# Altium project BLE_HID_Gamepad.PrjPcb
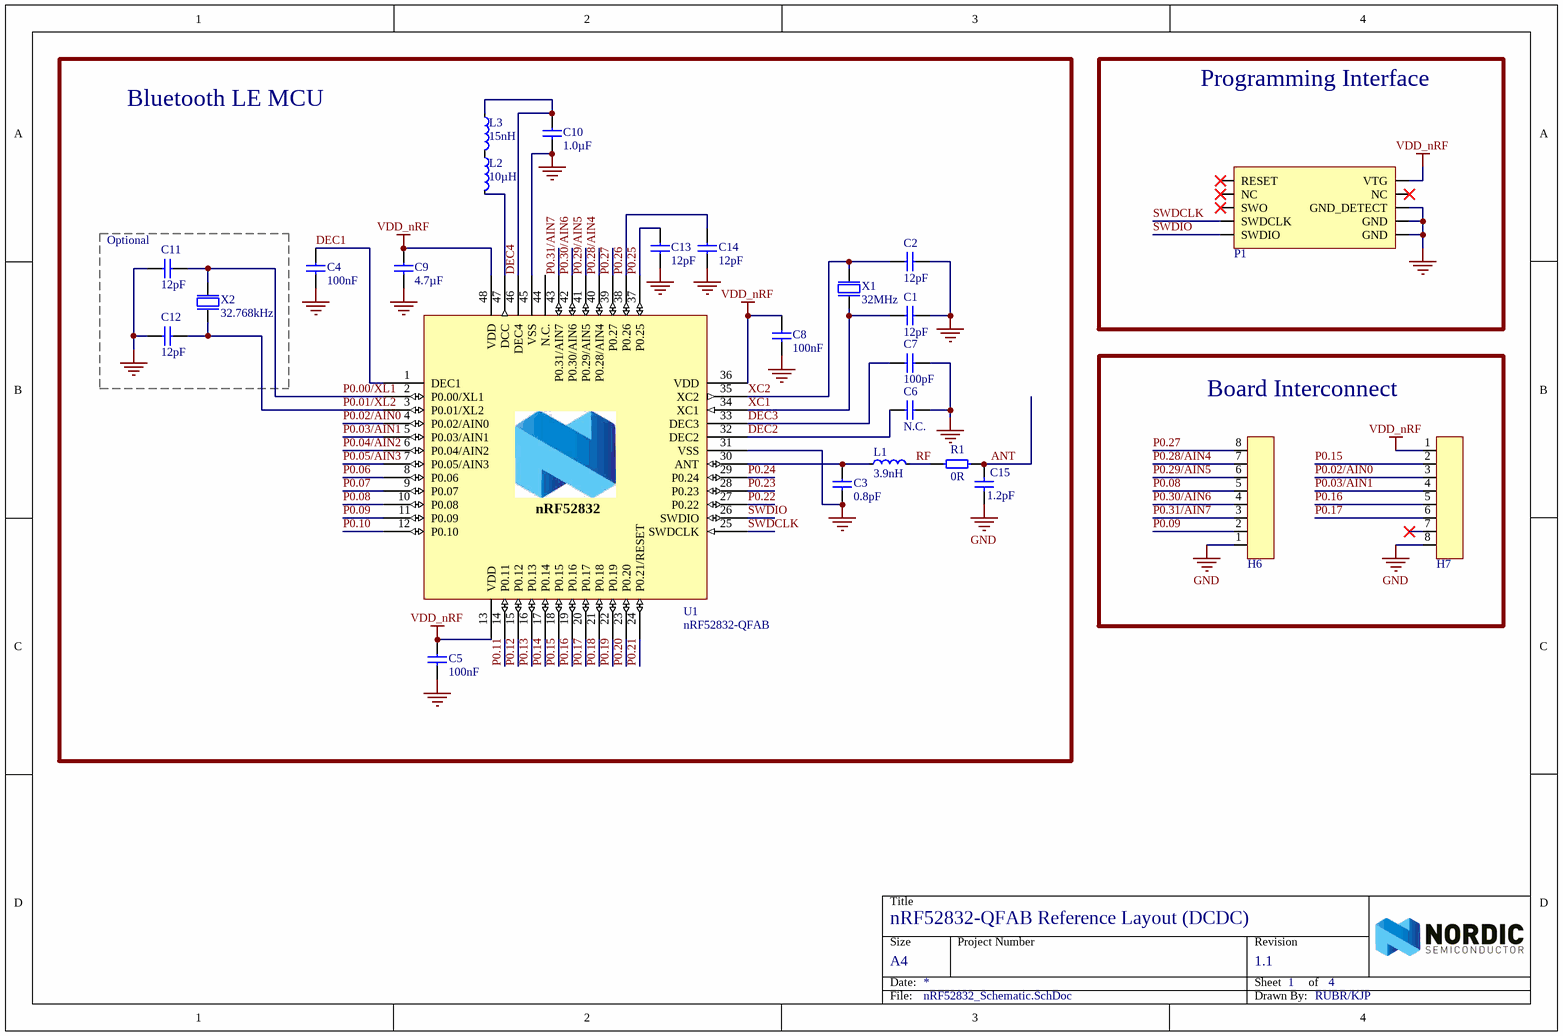
[diagram p0: nRF52832_Schematic.SchDoc]
4 sheets, 133 parts. Net scope: global (net labels, ports and power ports of the same name join across sheets).
Board file: BLE_Gamepad_PCB.PcbDoc
Sheets:
  nRF52832_Schematic.SchDoc
  Gamepad_IO.SchDoc
  Battery_Manager.SchDoc
  Gamepad_Sensors.SchDoc

## Sheet nRF52832_Schematic.SchDoc: nRF52832-QFAB Reference Layout (DCDC)
size A4; Revision: 1.1; SheetNumber: 1; SheetTotal: 4; DrawnBy: RUBR/KJP; DocumentSize: A4; PCAName: nRF52832-QFAB Reference Layout (DCDC)

### Parts
C1  12pF  [CAPC1005X04L]
C2  12pF  [CAPC1005X04L]
C3  0.8pF  [CAPC1005X04L]
C4  100nF  [CAPC1005X04L]
C5  100nF  [CAPC1005X04L]
C6  N.C.  [CAPC1005X04L]
C7  100pF  [CAPC1005X04L]
C8  100nF  [CAPC1005X04L]
C9  4.7µF  [CAPC1608X06L]
C10  1.0µF  [CAPC1608X06L]
C11  12pF  [CAPC1005X04L]
C12  12pF  [CAPC1005X04L]
C13  12pF  [CAPC1005X04L]
C14  12pF  [CAPC1005X04L]
C15  1.2pF  [0603 RF]
H6  8x1 Header  [SMD Header Male]  (value not drawn)
H7  8x1 Header  [SMD Header Male]  (value not drawn)
L1  3.9nH  [INDC1005X04L]
L2  10µH  [INDC1608X06L]
L3  15nH  [INDC1005X04L]
P1  JTag Connector  [JTAG 10 pin SMD]  (value not drawn)
R1  0R  [0603 RF]
U1  nRF52832-QFAB  [QFN40P600X600X90-48N]
X1  32MHz  [BT-XTAL_2016]
X2  32.768kHz  [XTAL_3215]

### Blocks framed on the sheet
Bluetooth LE MCU: C1-C15 L1-L3 R1 U1 X1 X2
Programming Interface: P1
Board Interconnect: H6 H7

### Nets
GND: C1.2 C2.2 C3.1 C4.2 C5.2 C6.1 C7.2 C8.2 C9.2 C10.1 C11.2 C12.2 C13.2 C14.2 C15.1 H6.1 H7.8 P1.7(GND) P1.8(GND) P1.10(GND_DETECT) U1.31(VSS) U1.45(VSS) U1.49(GND) X1.2(GND) X1.4(GND)
VDD_nRF: C5.1 C8.1 C9.1 H7.1 P1.6(VTG) U1.13(VDD) U1.36(VDD) U1.48(VDD)
ANT: C15.2 R1.2
DEC1: C4.1 U1.1(DEC1)
DEC2: C6.2 U1.32(DEC2)
DEC3: C7.1 U1.33(DEC3)
DEC4: C10.2 L3.1 U1.46(DEC4)
P0.00/XL1: C11.1 U1.2(P0.00/XL1) X2.1(inp)
P0.01/XL2: C12.1 U1.3(P0.01/XL2) X2.2(out)
P0.02/AIN0: H7.3 U1.4(P0.02/AIN0)
P0.03/AIN1: H7.4 U1.5(P0.03/AIN1)
P0.04/AIN2: U1.6(P0.04/AIN2)
P0.05/AIN3: U1.7(P0.05/AIN3)
P0.06: U1.8(P0.06)
P0.07: U1.9(P0.07)
P0.08: H6.5 U1.10(P0.08)
P0.09: H6.2 U1.11(P0.09)
P0.10: U1.12(P0.10)
P0.11: U1.14(P0.11)
P0.12: U1.15(P0.12)
P0.13: U1.16(P0.13)
P0.14: U1.17(P0.14)
P0.15: H7.2 U1.18(P0.15)
P0.16: H7.5 U1.19(P0.16)
P0.17: H7.6 U1.20(P0.17)
P0.18: U1.21(P0.18)
P0.19: U1.22(P0.19)
P0.20: U1.23(P0.20)
P0.21: U1.24(P0.21/RESET)
P0.22: U1.27(P0.22)
P0.23: U1.28(P0.23)
P0.24: U1.29(P0.24)
P0.25: C13.1 U1.37(P0.25)
P0.26: C14.1 U1.38(P0.26)
P0.27: H6.8 U1.39(P0.27)
P0.28/AIN4: H6.7 U1.40(P0.28/AIN4)
P0.29/AIN5: H6.6 U1.41(P0.29/AIN5)
P0.30/AIN6: H6.4 U1.42(P0.30/AIN6)
P0.31/AIN7: H6.3 U1.43(P0.31/AIN7)
RF: L1.2 R1.1
SWDCLK: P1.4(SWDCLK) U1.25(SWDCLK)
SWDIO: P1.5(SWDIO) U1.26(SWDIO)
XC1: C1.1 U1.34(XC1) X1.1(inp)
XC2: C2.1 U1.35(XC2) X1.3(out)
NetC3_2: C3.2 L1.1 U1.30(ANT)
NetL2_1: L2.1 L3.2
NetL2_2: L2.2 U1.47(DCC)

Not connected (* = marked no-connect by the designer): H7 7*; P1 1(RESET)* 2(NC)* 3(SWO)* 9(NC)*; U1 44(N.C.)

### Notes on the sheet
- (near C11) Optional
- Title
- Size
- Date:
- Project Number
- Sheet         of
- Revision
- File:
- Drawn By:
- (in symbol nRF52832-QFAB) nRF52832

### Library data of the parts
C1 C2 C11-C14 = C0402-12p: Capacitor, NP0, ±2%; Note: 50V; Artikkelnr Noca: 20029159; Artikkelnr Simpro: N.A.; Part Number: C0402-12p; Manufacturer: *; Manufacturer Part Number: *; Datasheet: *; LatestRevisionDate: 2011-05-11; Pin Count: 2; Publisher: Nordic Semiconductor; Published: 2009-05-08; Value: 12pF; Supplier: *; Supplier part number: *; 2nd source Supplier: *; 2nd source part number: *; Footprint Doc: 0402
C3 = C0402-0.8p: Capacitor, NP0, ±5%; Note: 50V; Artikkelnr Noca: 20029147; Artikkelnr Simpro: N.A.; Part Number: C0402-0.8p; Manufacturer: *; Manufacturer Part Number: *; Datasheet: *; LatestRevisionDate: 2012-11-21; Pin Count: 2; Publisher: Nordic Semiconductor; Published: 2009-05-08; Value: 0.8pF; Supplier: *; Supplier part number: *; 2nd source Supplier: *; 2nd source part number: *; Footprint Doc: 0402
C4 C5 C8 = C0402-100n: Capacitor, X7R, ±10%; Note: 16V; Artikkelnr Noca: 20039200; Artikkelnr Simpro: N.A.; Part Number: C0402-100n; Manufacturer: *; Manufacturer Part Number: *; Datasheet: *; LatestRevisionDate: 2009-11-23; Pin Count: 2; Publisher: Nordic Semiconductor; Published: 2009-05-08; Value: 100nF; Supplier: *; Supplier part number: *; 2nd source Supplier: *; 2nd source part number: *; Footprint Doc: 0402
C6 = C0402-N.C.: Not mounted; Note: Chip Cap; Artikkelnr Noca: N.A.; Part Number: C0402-N.C.; Manufacturer: *; Manufacturer Part Number: *; Datasheet: *; LatestRevisionDate: 2009-05-08; Pin Count: 2; Publisher: Nordic Semiconductor; Published: 2009-05-08; Value: N.C.; Supplier: *; Supplier part number: *; 2nd source Supplier: *; 2nd source part number: *; Footprint Doc: 0402; Artikkelnr Simpro: N.A.
C7 = C0402-100p: Capacitor, NP0, ±5%; Note: 50V; Artikkelnr Noca: 20029135; Artikkelnr Simpro: N.A.; Part Number: C0402-100p; Manufacturer: *; Manufacturer Part Number: *; Datasheet: *; LatestRevisionDate: 2009-05-08; Pin Count: 2; Publisher: Nordic Semiconductor; Published: 2009-05-08; Value: 100pF; Supplier: *; Supplier part number: *; 2nd source Supplier: *; 2nd source part number: *; Footprint Doc: 0402
C9 = C0603-4µ7: Capacitor, X5R, ±10%; Note: 6.3V; Artikkelnr Noca: 20069060; Artikkelnr Simpro: N.A.; Part Number: C0603-4µ7; Manufacturer: *; Manufacturer Part Number: *; Datasheet: *; LatestRevisionDate: 2009-11-23; Pin Count: 2; Publisher: Nordic Semiconductor; Published: 2009-05-08; Value: 4.7µF; Supplier: *; Supplier part number: *; 2nd source Supplier: *; 2nd source part number: *; Footprint Doc: 0603
C10 = C0603-1µ0: Capacitor, X7R, ±10%; Note: 16V; Artikkelnr Noca: 20039335; Artikkelnr Simpro: N.A.; Part Number: C0603-1µ0; Manufacturer: *; Manufacturer Part Number: *; Datasheet: *; LatestRevisionDate: 2013-06-05; Pin Count: 2; Publisher: Nordic Semiconductor; Published: 2009-05-08; Value: 1.0µF; Supplier: *; Supplier part number: *; 2nd source Supplier: *; 2nd source part number: *; Footprint Doc: 0603
C15 = Capacitor
L1 = L0402-3n9: High frequency chip inductor ±5%; Manufacturer: Murata; Manufacturer Part Number: LQP15MN3N9B02D; Artikkelnr Noca: 33029151; Artikkelnr Simpro: N.A.; Part Number: L0402-3n9; Datasheet: http://search.murata.co.jp/Ceramy/image/img/PDF/ENG/L0075S0084LQP15M.pdf; LatestRevisionDate: 2012-09-19; Pin Count: 2; Publisher: Nordic Semiconductor; Published: 2009-05-08; Value: 3.9nH; Note: High frequency chip inductor ±5%; Supplier: Digi-Key; Supplier part number: 490-1131-1-ND; 2nd source Supplier: *; 2nd source part number: *; Footprint Doc: 0402
L2 = L0603-10µ: Chip inductor, IDC,min = 50 mA, ±20%; Manufacturer: Taiyo Yuden; Manufacturer Part Number: LBMF1608T100K; 2nd source part number: 178-6105; Note: LBMF1608T100K 10µH 80mA 0603; Artikkelnr Noca: 33029314; Artikkelnr Simpro: N.A.; Part Number: L0603-10µ; Datasheet: http://www.yuden.co.jp/ut/product/pdf/elb2_e.pdf; LatestRevisionDate: 2012-09-19; Pin Count: 2; Publisher: Nordic Semiconductor; Published: 2010-02-24; Value: 10µH; Supplier: Digi-Key; Supplier part number: 587-1714-1-ND; 2nd source Supplier: Farnell; Footprint Doc: 0603
L3 = L0402-15n: High frequency chip inductor ±10%; Manufacturer: Taiyo Yuden; Manufacturer Part Number: HK100515NJ-T; 2nd source part number: 658-1328; Artikkelnr Noca: 33029323; Artikkelnr Simpro: N.A.; Part Number: L0402-15n; LatestRevisionDate: 2012-09-19; Pin Count: 2; Publisher: Nordic Semiconductor; Published: 2010-07-12; Value: 15nH; Note: High frequency chip inductor ±10%; Supplier: Digi-Key; Datasheet: http://www.yuden.co.jp/productdata/catalog/en/mlci04_e.pdf; Supplier part number: 587-1521-1-ND; 2nd source Supplier: Farnell; Footprint Doc: 0402
P1 = JTag Connector: SAMTEC - FTSH-105-01-F-DV-K - Pin Header, Keying Shroud, Wire-to-Board, 1.27 mm, 2 Rows, 10 Contacts, Surface Mount, FTSH Series; Max Current Rating: 1.75A; Number of Positions: 10; Connector Type: Male Pin; Pitch: 1.27mm; Row Spacing: 0.05inch; Supplier 1: Digi-Key; Manufacturer 1: Samtec; Manufacturer Part Number 1: FTSH-105-01-F-DV-K; RoHS: Yes; Category: Headers and Wire Housings; Stock 1: 4170; Pricing 1: 1=2.84000, 10=2.73100, 100=2.27590, 500=1.93452, 1000=1.65004, 5000=1.47934 (USD); Mount: Surface Mount; Contact Material: Copper,Bronze; Contact Plating: Gold; Color: Black; Housing Color: Black; Housing Material: Polymer; Min Operating Temperature: -55°C; Max Operating Temperature: 125°C; Number of Rows: 2; Packaging: Rail/Tube; Package Quantity: 1; Termination: Solder; Number of Contacts: 10; Orientation: Straight; Series: FTSH; Contact Type: Male Pin; Length: 15.2mm; Height: 3.3mm; Contact Mating Length: 0.12inch; Depth: 3.43mm; Radiation Hardening: No; Lead Free: Lead Free; RoHS Compliant: Yes; ComponentLink1URL: https://datasheet.ciiva.com/19461/2046846-19461026.pdf?src-supplier=Jameco; ComponentLink1Description: https://datasheet.ciiva.com/19461/2046846-19461026.pdf?src-supplier=Jameco; ComponentLink2URL: https://datasheet.ciiva.com/738/ftsh-1xx-xx-xxx-dv-xxx-mkt-738998.pdf?src-supplier=Digi-Key; ComponentLink2Description: https://datasheet.ciiva.com/738/ftsh-1xx-xx-xxx-dv-xxx-mkt-738998.pdf?src-supplier=Digi-Key; ComponentLink3URL: https://datasheet.ciiva.com/10245/ftsh-mt-10245273.pdf?src-supplier=Avnet; ComponentLink3Description: https://datasheet.ciiva.com/10245/ftsh-mt-10245273.pdf?src-supplier=Avnet; ComponentLink4URL: https://datasheet.ciiva.com/16657/ftsh-mt-16657371.pdf?src-supplier=Avnet+Europe; ComponentLink4Description: https://datasheet.ciiva.com/16657/ftsh-mt-16657371.pdf?src-supplier=Avnet+Europe; ComponentLink5URL: https://datasheet.ciiva.com/15195/getdatasheetpartid-133463-15195260.pdf?src-supplier=Verical; ComponentLink5Description: https://datasheet.ciiva.com/15195/getdatasheetpartid-133463-15195260.pdf?src-supplier=Verical; Supplier Part Number 1: SAM8796-ND
R1 = Resistor
U1 = nRF52832-QFAB: Multi-protocol Bluetooth Low Energy, ANT and 2.4GHz proprietary system-on-chip; Manufacturer: Nordic Semiconductor; Artikkelnr Noca: N.A.; Part Number: nRF52832-QFAB; Manufacturer Part Number: nRF52832-QFAB; Datasheet: *; LatestRevisionDate: 2016-11-24; Pin Count: 48; Publisher: Nordic Semiconductor; Published: 2016-11-24; Value: nRF52832-QFAB; Note: *; Supplier: Nordic Semiconductor; Supplier part number: *; 2nd source Supplier: *; 2nd source part number: *; Footprint Doc: QFN-48; Artikkelnr Simpro: N.A.
X1 = XTAL_SMD2016_32MHz_8pF_General: XTAL SMD 2016, 32MHz, Cl=8pF, Total Tol: ±40ppm; Note: XTAL SMD 32.000MHz; Artikkelnr Noca: N.A.; Part Number: XTAL_SMD2016_32MHz_8pF_General; Manufacturer: *; Manufacturer Part Number: *; Datasheet: *; LatestRevisionDate: 2016-08-19; Pin Count: 4; Publisher: Nordic Semiconductor; Published: 2016-08-19; Value: 32MHz; Supplier: *; Supplier part number: *; 2nd source Supplier: *; 2nd source part number: *; Footprint Doc: XTAL_2016; Artikkelnr Simpro: N.A.
X2 = XTAL_SMD3215_32.768kHz_9pF_General: XTAL SMD 3215, 32.768kHz, Cl=9pF, Total Tol: ±50ppm; Note: XTAL SMD 32.768kHz; Artikkelnr Noca: N.A.; Part Number: XTAL_SMD3215_32.768kHz_9pF_General; Manufacturer: *; Manufacturer Part Number: *; Datasheet: *; LatestRevisionDate: 2016-08-19; Pin Count: 2; Publisher: Nordic Semiconductor; Published: 2016-08-19; Value: 32.768kHz; Supplier: *; Supplier part number: *; 2nd source Supplier: *; 2nd source part number: *; Footprint Doc: XTAL_3215; Artikkelnr Simpro: N.A.

## Sheet Gamepad_IO.SchDoc
size A; SheetNumber: 2; SheetTotal: 4
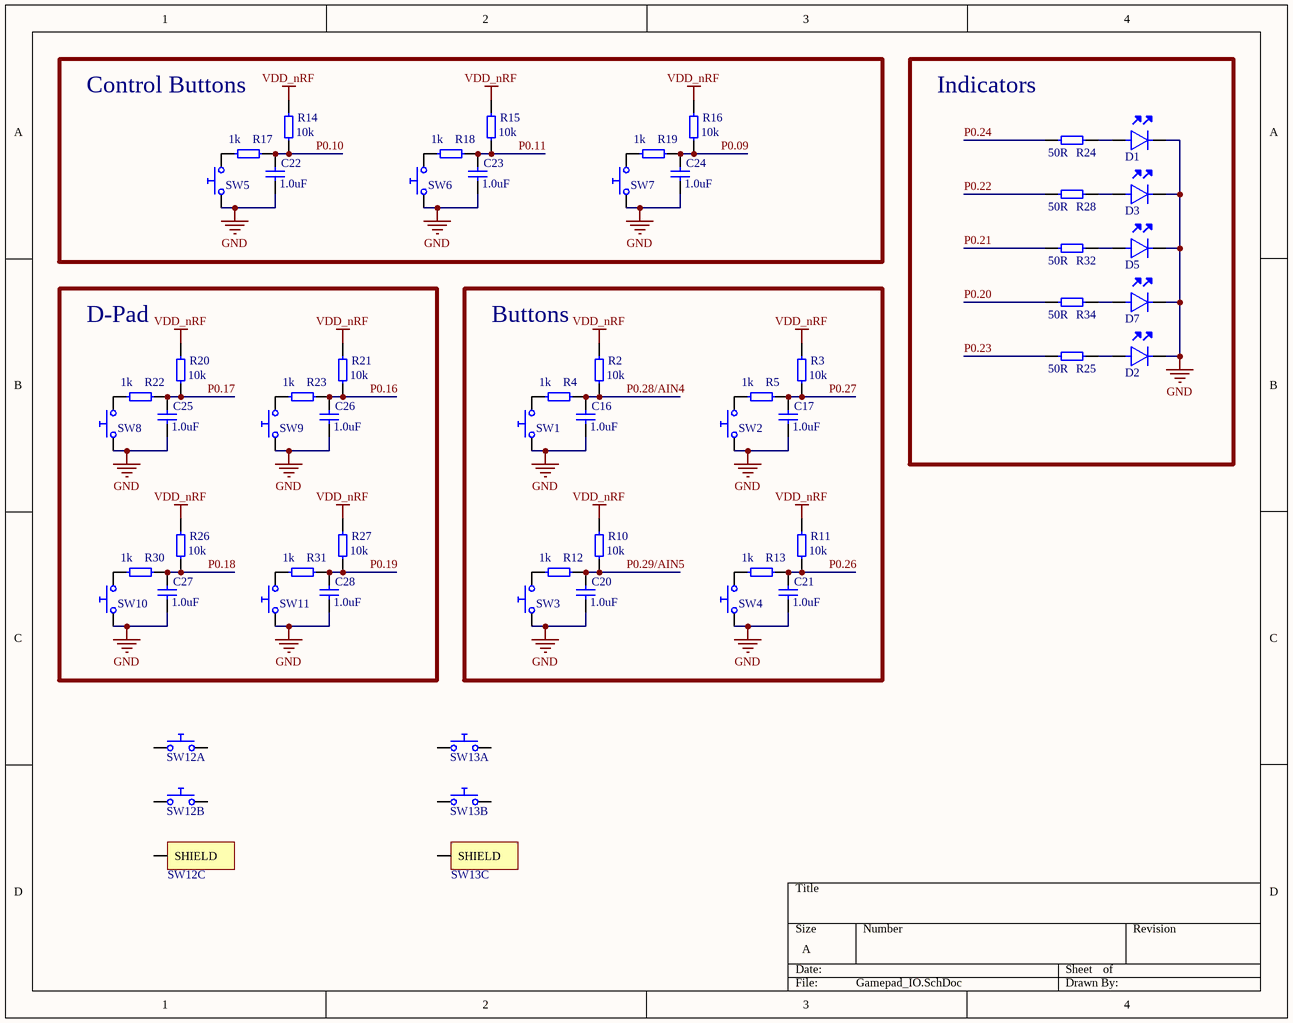
[diagram p1: Gamepad_IO.SchDoc]

### Parts
C16  1.0uF  [0603 Capacitor]
C17  1.0uF  [0603 Capacitor]
C20  1.0uF  [0603 Capacitor]
C21  1.0uF  [0603 Capacitor]
C22  1.0uF  [0603 Capacitor]
C23  1.0uF  [0603 Capacitor]
C24  1.0uF  [0603 Capacitor]
C25  1.0uF  [0603 Capacitor]
C26  1.0uF  [0603 Capacitor]
C27  1.0uF  [0603 Capacitor]
C28  1.0uF  [0603 Capacitor]
D1  LED  [0603 LED]  (value not drawn)
D2  LED  [0603 LED]  (value not drawn)
D3  LED  [0603 LED]  (value not drawn)
D5  LED  [0603 LED]  (value not drawn)
D7  LED  [0603 LED]  (value not drawn)
R2  10k  [0603 Resistor]
R3  10k  [0603 Resistor]
R4  1k  [0603 Resistor]
R5  1k  [0603 Resistor]
R10  10k  [0603 Resistor]
R11  10k  [0603 Resistor]
R12  1k  [0603 Resistor]
R13  1k  [0603 Resistor]
R14  10k  [0603 Resistor]
R15  10k  [0603 Resistor]
R16  10k  [0603 Resistor]
R17  1k  [0603 Resistor]
R18  1k  [0603 Resistor]
R19  1k  [0603 Resistor]
R20  10k  [0603 Resistor]
R21  10k  [0603 Resistor]
R22  1k  [0603 Resistor]
R23  1k  [0603 Resistor]
R24  50R  [0603 Resistor]
R25  50R  [0603 Resistor]
R26  10k  [0603 Resistor]
R27  10k  [0603 Resistor]
R28  50R  [0603 Resistor]
R30  1k  [0603 Resistor]
R31  1k  [0603 Resistor]
R32  50R  [0603 Resistor]
R34  50R  [0603 Resistor]
SW1  Switch Button  [ButtonPad Version 1]  (value not drawn)
SW2  Switch Button  [ButtonPad Version 1]  (value not drawn)
SW3  Switch Button  [ButtonPad Version 1]  (value not drawn)
SW4  Switch Button  [ButtonPad Version 1]  (value not drawn)
SW5  Switch Button  [ButtonPad Version 1]  (value not drawn)
SW6  Switch Button  [ButtonPad Version 1]  (value not drawn)
SW7  Switch Button  [ButtonPad Version 1]  (value not drawn)
SW8  Switch Button  [ButtonPad Version 1]  (value not drawn)
SW9  Switch Button  [ButtonPad Version 1]  (value not drawn)
SW10  Switch Button  [ButtonPad Version 1]  (value not drawn)
SW11  Switch Button  [ButtonPad Version 1]  (value not drawn)
SW12  TL2243  [TL2243]  (value not drawn)  (parts A,B,C of 3)
SW13  TL2243  [TL2243]  (value not drawn)  (parts A,B,C of 3)

### Blocks framed on the sheet
Control Buttons: C22-C24 R14-R19 SW5-SW7
Indicators: D1-D3 D5 D7 R24 R25 R28 R32 R34
D-Pad: C25-C28 R20-R23 R26 R27 R30 R31 SW8-SW11
Buttons: C16 C17 C20 C21 R2-R5 R10-R13 SW1-SW4

### Nets
GND: C16.1 C17.1 C20.1 C21.1 C22.1 C23.1 C24.1 C25.1 C26.1 C27.1 C28.1 D1.2 D2.2 D3.2 D5.2 D7.2 SW1.1 SW2.1 SW3.1 SW4.1 SW5.1 SW6.1 SW7.1 SW8.1 SW9.1 SW10.1 SW11.1
VDD_nRF: R2.2 R3.2 R10.2 R11.2 R14.2 R15.2 R16.2 R20.2 R21.2 R26.2 R27.2
P0.09: C24.2 R16.1 R19.2
P0.10: C22.2 R14.1 R17.2
P0.11: C23.2 R15.1 R18.2
P0.16: C26.2 R21.1 R23.2
P0.17: C25.2 R20.1 R22.2
P0.18: C27.2 R26.1 R30.2
P0.19: C28.2 R27.1 R31.2
P0.20: R34.1
P0.21: R32.1
P0.22: R28.1
P0.23: R25.1
P0.24: R24.1
P0.26: C21.2 R11.1 R13.2
P0.27: C17.2 R3.1 R5.2
P0.28/AIN4: C16.2 R2.1 R4.2
P0.29/AIN5: C20.2 R10.1 R12.2
NetD1_1: D1.1 R24.2
NetD2_1: D2.1 R25.2
NetD3_1: D3.1 R28.2
NetD5_1: D5.1 R32.2
NetD7_1: D7.1 R34.2
NetR4_1: R4.1 SW1.2
NetR5_1: R5.1 SW2.2
NetR12_1: R12.1 SW3.2
NetR13_1: R13.1 SW4.2
NetR17_1: R17.1 SW5.2
NetR18_1: R18.1 SW6.2
NetR19_1: R19.1 SW7.2
NetR22_1: R22.1 SW8.2
NetR23_1: R23.1 SW9.2
NetR30_1: R30.1 SW10.2
NetR31_1: R31.1 SW11.2

Not connected (* = marked no-connect by the designer): SW12 1 2 3 4 SHIELD; SW13 1 2 3 4 SHIELD

### Library data of the parts
C16 C17 C20-C28 = Capacitor
R2-R5 R10-R28 R30-R32 R34 = Resistor
SW12 SW13 = TL2243: SWITCH TACTILE SPSTX2 0.05A 12V; Manufacturer 1: E-Switch; Mechanical Life: 30000Cycles; Voltage Rating (DC): 100V; Throw Configuration: SPST; Contact Resistance: 100mR; Operating Force: 180gf; Current Rating: 50mA; Illumination Type: Non-Illuminated,Illuminated; Switch Travel: 0.25mm; Switch Function: Off-Mom; Actuator Length: 3.8mm; Supplier 1: Digi-Key; Supplier Part Number 1: EG4606-ND; Manufacturer Part Number 1: TL2243; RoHS: Yes; Category: Tactile Switches; Stock 1: 5183; Pricing 1: 1=0.69000, 10=0.66200, 25=0.63640, 100=0.55230, 250=0.50396, 500=0.46832, 1000=0.41996, 2500=0.39450, 5000=0.36651 (USD); Mount: Through Hole; Contact Material: Silver; Min Operating Temperature: -20°C; Max Operating Temperature: 70°C; Package Quantity: 600; Packaging: Bulk; Max Voltage Rating (DC): 12V; Termination: PC Pin; Electrical Life: 30000Cycles; Orientation: Right Angle; Series: TL2243; Size: 7.3mm; Lead Free: Lead Free; RoHS Compliant: Yes; ComponentLink1URL: https://datasheet.ciiva.com/2900/tl2243-2900969.pdf?src-supplier=Digi-Key; ComponentLink1Description: https://datasheet.ciiva.com/2900/tl2243-2900969.pdf?src-supplier=Digi-Key; ComponentLink2URL: https://datasheet.ciiva.com/13526/tl2243-26358-13526538.pdf?src-supplier=Mouser; ComponentLink2Description: https://datasheet.ciiva.com/13526/tl2243-26358-13526538.pdf?src-supplier=Mouser; ComponentLink3URL: https://datasheet.ciiva.com/31840/p010405-31840495.pdf?src-supplier=Onlinecomponents.com; ComponentLink3Description: https://datasheet.ciiva.com/31840/p010405-31840495.pdf?src-supplier=Onlinecomponents.com; ComponentLink4URL: https://datasheet.ciiva.com/16370/p010405m-16370087.pdf?src-supplier=Future+Electronics; ComponentLink4Description: https://datasheet.ciiva.com/16370/p010405m-16370087.pdf?src-supplier=Future+Electronics

## Sheet Battery_Manager.SchDoc
size A; SheetNumber: 3; SheetTotal: 4
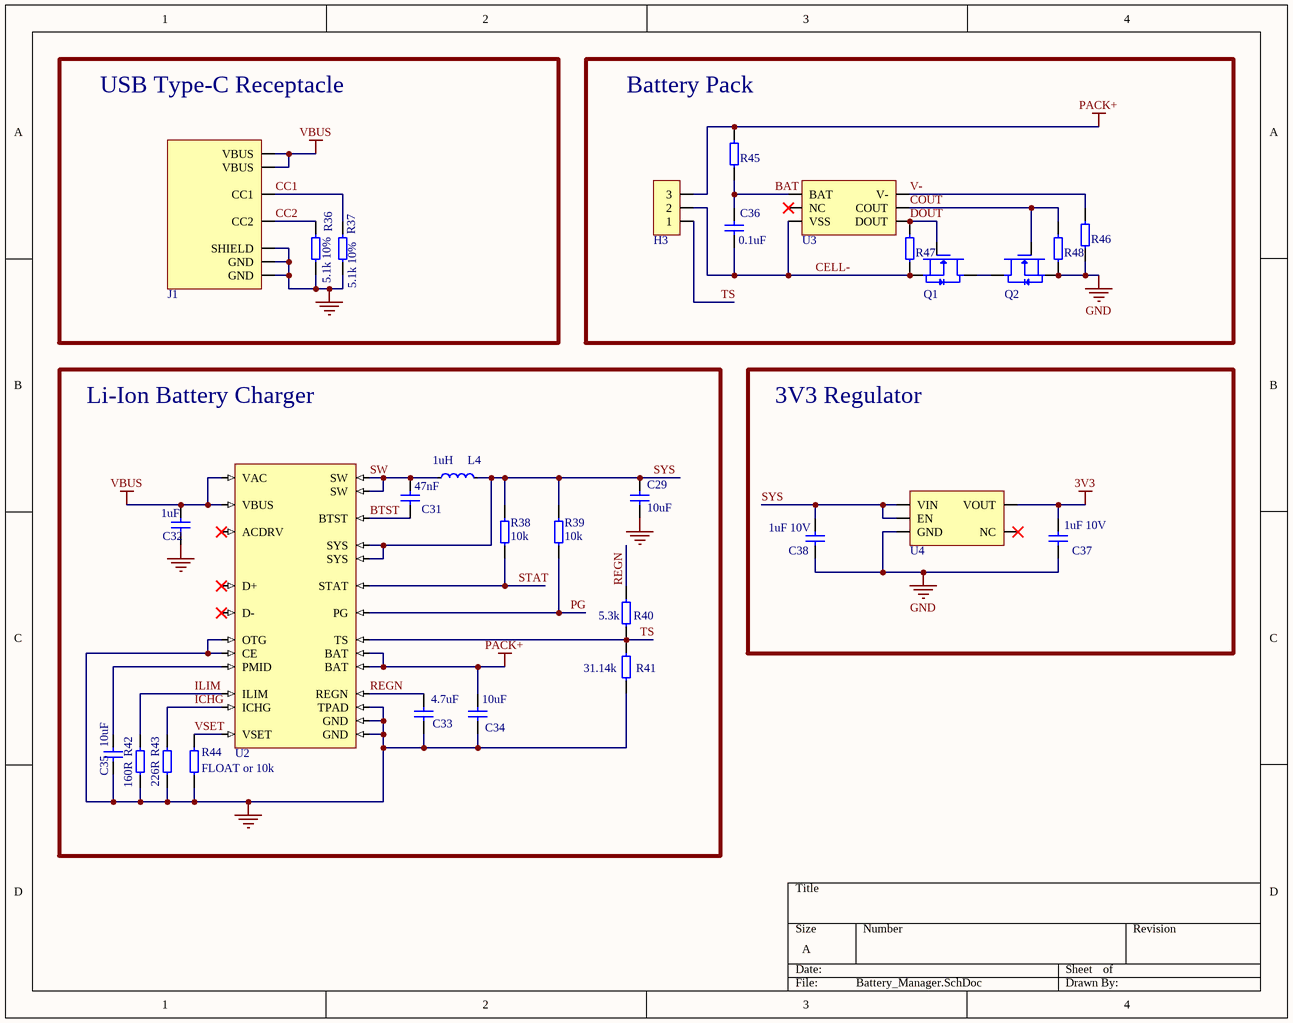
[diagram p2: Battery_Manager.SchDoc]

### Parts
C29  10uF  [0603 Capacitor]
C31  47nF  [0603 Capacitor]
C32  1uF  [0603 Capacitor]
C33  4.7uF  [0603 Capacitor]
C34  10uF  [0603 Capacitor]
C35  10uF  [0603 Capacitor]
C36  0.1uF  [0603 Capacitor]
C37  1uF 10V  [0603 Capacitor]
C38  1uF 10V  [0603 Capacitor]
H3  22-05-7035  [Molex Header 3]  (value not drawn)
J1  USB4125-GF-A  [USB4125]  (value not drawn)
L4  1uH  [SRP2510A]
Q1  CSD16406Q3  [CSD16406Q3]  (value not drawn)
Q2  CSD16406Q3  [CSD16406Q3]  (value not drawn)
R36  5.1k 10%  [0603 Resistor]
R37  5.1k 10%  [0603 Resistor]
R38  10k  [0603 Resistor]
R39  10k  [0603 Resistor]
R40  5.3k  [0603 Resistor]
R41  31.14k  [0603 Resistor]
R42  160R  [0603 Resistor]
R43  226R  [0603 Resistor]
R44  FLOAT or 10k  [0603 Resistor]
R45  330R  [0603 Resistor]  (value not drawn)
R46  2.2k  [0603 Resistor]  (value not drawn)
R47  5M  [0603 Resistor]  (value not drawn)
R48  5M  [0603 Resistor]  (value not drawn)
U2  BQ25616JRTWR  [BQ25616]  (value not drawn)
U3  BQ29700DSET  [BQ297xx]  (value not drawn)
U4  MIC5504-3.3YM5-TR  [MIC5504]  (value not drawn)

### Blocks framed on the sheet
USB Type-C Receptacle: J1 R36 R37
Battery Pack: C36 H3 Q1 Q2 R45-R48 U3
Li-Ion Battery Charger: C29 C31-C35 L4 R38-R44 U2
3V3 Regulator: C37 C38 U4

### Nets
3V3: C37.2 U4.5(VOUT)
GND: C29.1 C32.1 C33.1 C34.1 C35.1 C37.1 C38.1 J1.A12(GND) J1.B12(GND) J1.SHIELD Q2.1 R36.1 R37.1 R41.1 R42.1 R43.1 R44.1 R46.1 R48.1 U2.6(OTG) U2.9(CE) U2.17(GND) U2.18(GND) U2.25(TPAD) U4.2(GND)
PACK+: C34.2 H3.3 R45.2 U2.13(BAT) U2.14(BAT)
VBUS: C32.2 J1.A9(VBUS) J1.B9(VBUS) U2.1(VAC) U2.24(VBUS)
BAT: C36.2 R45.1 U3.5(BAT)
BTST: C31.1 U2.21(BTST)
CC1: J1.A5(CC1) R37.2
CC2: J1.B5(CC2) R36.2
CELL-: C36.1 H3.2 Q1.1 R47.1 U3.4(VSS)
COUT: Q2.4 R48.2 U3.2(COUT)
DOUT: Q1.4 R47.2 U3.3(DOUT)
ICHG: R43.2 U2.10(ICHG)
ILIM: R42.2 U2.8(ILIM)
PG: R39.1 U2.7(PG)
REGN: C33.2 R40.2 U2.22(REGN)
STAT: R38.1 U2.5(STAT)
SW: C31.2 L4.1 U2.19(SW) U2.20(SW)
SYS: C29.2 C38.2 L4.2 R38.2 R39.2 U2.15(SYS) U2.16(SYS) U4.1(VIN) U4.3(EN)
TS: H3.1 R40.1 R41.2 U2.11(TS)
V-: R46.2 U3.6(V-)
VSET: R44.2 U2.12(VSET)
NetC35_2: C35.2 U2.23(PMID)
NetQ1_5: Q1.5 Q2.5

Not connected (* = marked no-connect by the designer): U2 2(ACDRV)* 3(D+)* 4(D-)*; U3 1(NC)*; U4 4(NC)*

### Library data of the parts
C29 C31-C38 = Capacitor
H3 = 22-05-7035: Header 2.5mm SPOX,  WTB,  RA,  F/lock,  3w; Manufacturer 1: Molex; Voltage Rating: 250V; Current Rating: 3A; Gender: Male; Contact Resistance: 20mR; Number of Positions: 3; Max Voltage Rating (DC): 250.25kV; Insulation Resistance: 1GR; Shrouded: Yes (With); Test Voltage: 1kV; Glow Wire Compliant: Non-compliant; Supplier 1: Digi-Key; Supplier Part Number 1: WM18901-ND; Manufacturer Part Number 1: 22-05-7035; RoHS: Yes; Category: Headers and Wire Housings; Stock 1: 4209; Pricing 1: 1=0.26000, 10=0.20600, 100=0.14770, 1000=0.11562, 5000=0.10278, 10000=0.09314 (USD); Mount: Through Hole; Contact Plating: Tin,Copper; Contact Material: Brass; Housing Color: Natural; Color: Natural; Housing Material: Nylon; Contact Shape: Circular; Contact Finish - Mating: TIN; Insulation Material: Nylon; Insulation Color: Natural; Min Operating Temperature: -40°C; Max Operating Temperature: 105°C; Package Quantity: 20000; Packaging: Bulk; Termination: Solder; Number of Rows: 1; Number of Contacts: 3; Orientation: Right Angle; Voltage Rating (DC): 250V; Number of Circuits: 3; Contact Gender: Male; Connector Type: Header; Max Voltage Rating (AC): 250V; Number of Poles: 3; Max Current Rating: 3A; Fastening Type: Detent; Series: Mini-SPOX 5268; Contact Type: Male Pin; Length: 9.9mm; Height: 4.9mm; Pitch: 2.5mm; Depth: 7.9mm; Radiation Hardening: No; REACH SVHC: Unknown; Lead Free: Lead Free; RoHS Compliant: Yes; Flammability Rating: UL94 V-0; ComponentLink1URL: https://datasheet.ciiva.com/30128/225440022057035-pcb-headers-30128301.pdf?src-supplier=Onlinecomponents.com; ComponentLink1Description: https://datasheet.ciiva.com/30128/225440022057035-pcb-headers-30128301.pdf?src-supplier=Onlinecomponents.com; ComponentLink2URL: https://datasheet.ciiva.com/11746/0900766b80da772d-11746287.pdf?src-supplier=RSComponents; ComponentLink2Description: https://datasheet.ciiva.com/11746/0900766b80da772d-11746287.pdf?src-supplier=RSComponents; ComponentLink3URL: https://datasheet.ciiva.com/5153/0022057035-pcb-headers-158546-5153221.pdf?src-supplier=Mouser; ComponentLink3Description: https://datasheet.ciiva.com/5153/0022057035-pcb-headers-158546-5153221.pdf?src-supplier=Mouser; ComponentLink4URL: https://datasheet.ciiva.com/19461/1965939-19461711.pdf?src-supplier=Jameco; ComponentLink4Description: https://datasheet.ciiva.com/19461/1965939-19461711.pdf?src-supplier=Jameco; ComponentLink5URL: https://datasheet.ciiva.com/7167/1869086-7167685.pdf?src-supplier=Newark; ComponentLink5Description: https://datasheet.ciiva.com/7167/1869086-7167685.pdf?src-supplier=Newark
J1 = USB4125-GF-A: Conn Rcp USB2.0 Typ C 24P SMD Ra; Manufacturer 1: GCT; Supplier 1: Digi-Key; Supplier Part Number 1: 1812J0160470FFT-ND; Manufacturer Part Number 1: USB4125-GF-A
L4 = SRP2510A-1R0M: BOURNS - SRP2510A-1R0M - INDUCTOR, 1UH, 3A, 20%, SHIELDED; Core Material: Ferrite; Saturation Current: 3.5A; DC Resistance (DCR): 54mR; Self Resonant Frequency: 94MHz; Test Frequency: 1MHz; Supplier 1: Digi-Key; Supplier Part Number 1: SRP2510A-1R0MCT-ND; Manufacturer 1: Bourns; Manufacturer Part Number 1: SRP2510A-1R0M; RoHS: Yes; Category: Fixed Inductors; Stock 1: 5280; Pricing 1: 1=0.53000, 10=0.46200, 25=0.42880, 50=0.36300, 100=0.33000, 250=0.31020, 500=0.27720, 1000=0.22440 (USD); Mount: Surface Mount; Case/Package: 1008; Case Code (Imperial): 1008; Case Code (Metric): 2520; Min Operating Temperature: -40°C; Max Operating Temperature: 125°C; Resistor Type: Wirewound; Packaging: Cut Tape; Inductance: 1uH; Tolerance: 20%; Current Rating: 3A; Shielding: Shielded; Ratings: AEC-Q200; RoHS Compliant: Yes; ComponentLink1URL: http://www.farnell.com/datasheets/2330876.pdf?src-supplier=Farnell; ComponentLink1Description: http://www.farnell.com/datasheets/2330876.pdf?src-supplier=Farnell; ComponentLink2URL: http://www.farnell.com/datasheets/2330876.pdf?src-supplier=Newark; ComponentLink2Description: http://www.farnell.com/datasheets/2330876.pdf?src-supplier=Newark; ComponentLink3URL: https://www.bourns.com/docs/Product-Datasheets/srp2510a.pdf?src-supplier=Digi-Key; ComponentLink3Description: https://www.bourns.com/docs/Product-Datasheets/srp2510a.pdf?src-supplier=Digi-Key
Q1 Q2 = CSD16406Q3: TEXAS INSTRUMENTS - CSD16406Q3 - N CHANNEL MOSFET, 25V, 60A, SON; Rise Time: 12.9ns; Rds On Max: 5.3mR; Input Capacitance: 1.1nF; Nominal Vgs: 1.7V; Max Power Dissipation: 2.7W; Fall Time: 4.8ns; Turn-Off Delay Time: 8.5ns; Gate to Source Voltage (Vgs): 16V; Turn-On Delay Time: 7.3ns; Number of Elements: 1; Element Configuration: Single; Polarity: N-CHANNEL; Supplier 1: Digi-Key; Supplier Part Number 1: 296-24251-1-ND; Manufacturer 1: Texas Instruments; Manufacturer Part Number 1: CSD16406Q3; RoHS: Yes; Category: MOSFETs; Stock 1: 13974; Pricing 1: 1=1.17000, 10=0.95900, 25=0.94160, 100=0.74610, 500=0.63244, 1000=0.51518 (USD); Mount: Surface Mount; Case/Package: SON; Number of Pins: 8; Contact Plating: Tin,Matte; Min Operating Temperature: -55°C; Max Operating Temperature: 150°C; Packaging: Tape and Reel; Package Quantity: 1; Dual Supply Voltage: 25V; Drain to Source Voltage (Vdss): 25V; Continuous Drain Current (ID): 60A; Drain to Source Breakdown Voltage: 25V; Power Dissipation: 2.7W; Termination: SMD/SMT; Threshold Voltage: 1.7V; Series: NexFET™; Radiation Hardening: No; REACH SVHC: No SVHC; Lead Free: Contains Lead; RoHS Compliant: Yes; ComponentLink1URL: https://datasheet.ciiva.com/14192/slps202a-14192882.pdf?src-supplier=Avnet; ComponentLink1Description: https://datasheet.ciiva.com/14192/slps202a-14192882.pdf?src-supplier=Avnet; ComponentLink2URL: https://datasheet.ciiva.com/6387/csd16406q3-6387192.pdf?src-supplier=Digi-Key; ComponentLink2Description: https://datasheet.ciiva.com/6387/csd16406q3-6387192.pdf?src-supplier=Digi-Key; ComponentLink3URL: https://datasheet.ciiva.com/4438/slps202a-128073-4438442.pdf?src-supplier=Mouser; ComponentLink3Description: https://datasheet.ciiva.com/4438/slps202a-128073-4438442.pdf?src-supplier=Mouser; ComponentLink4URL: https://datasheet.ciiva.com/1255/csd16406q3-1255292.pdf?src-supplier=Newark; ComponentLink4Description: https://datasheet.ciiva.com/1255/csd16406q3-1255292.pdf?src-supplier=Newark; ComponentLink5URL: https://datasheet.ciiva.com/5832/483980-5832634.pdf?src-supplier=Farnell; ComponentLink5Description: https://datasheet.ciiva.com/5832/483980-5832634.pdf?src-supplier=Farnell; ComponentLink6URL: https://datasheet.ciiva.com/5832/483980-5832635.pdf?src-supplier=Farnell; ComponentLink6Description: https://datasheet.ciiva.com/5832/483980-5832635.pdf?src-supplier=Farnell; ComponentLink7URL: https://datasheet.ciiva.com/7643/1389665-7643292.pdf?src-supplier=Element14; ComponentLink7Description: https://datasheet.ciiva.com/7643/1389665-7643292.pdf?src-supplier=Element14; ComponentLink8URL: https://datasheet.ciiva.com/14423/slps202a-14423477.pdf?src-supplier=Avnet; ComponentLink8Description: https://datasheet.ciiva.com/14423/slps202a-14423477.pdf?src-supplier=Avnet; ComponentLink9URL: https://datasheet.ciiva.com/6387/csd16406q3-6387195.pdf?src-supplier=Digi-Key; ComponentLink9Description: https://datasheet.ciiva.com/6387/csd16406q3-6387195.pdf?src-supplier=Digi-Key; ComponentLink10URL: https://datasheet.ciiva.com/6387/csd16406q3-6387198.pdf?src-supplier=Digi-Key; ComponentLink10Description: https://datasheet.ciiva.com/6387/csd16406q3-6387198.pdf?src-supplier=Digi-Key
R36-R48 = Resistor
U2 = BQ25616JRTWR: Manufacturer 1: Texas Instruments; Supplier 1: Digi-Key; Supplier Part Number 1: 296-BQ25616JRTWRCT-ND; Manufacturer Part Number 1: BQ25616JRTWR; RoHS: Yes; Category: Battery Management; Stock 1: 553; Pricing 1: 1=3.10000, 10=2.78100, 25=2.62360, 100=2.23520, 250=2.09880, 500=1.83644, 1000=1.65330 (USD)
U3 = BQ29700DSET: Li-Ion/Li Polymer Advanced Single-Cell Battery Protector IC Family 6-WSON -40 to 85; Manufacturer 1: Texas Instruments; Number of Batteries: 1; Min Supply Voltage: 1.5V; Max Supply Voltage: 8V; Output Voltage: 28V; Output Current: 5.5uA; Operating Supply Current: 4uA; Fault Protection: Over Current,Short Circuit,Over/Under Voltage; Supplier 1: Digi-Key; Supplier Part Number 1: 296-37746-1-ND; Manufacturer Part Number 1: BQ29700DSET; RoHS: Yes; Category: Battery Management; Stock 1: 86; Pricing 1: 1=0.69000, 10=0.60500, 25=0.56840, 100=0.43090 (USD); Mount: Surface Mount; Case/Package: WFDFN; Number of Pins: 6; Weight: 0.000342oz; Contact Plating: Gold; Min Operating Temperature: -40°C; Max Operating Temperature: 85°C; Packaging: Tape and Reel; Number of Cells: 1; Max Output Voltage: 8V; Package Quantity: 250; Length: 1.55mm; Width: 1.55mm; Height: 0.8mm; Radiation Hardening: No; REACH SVHC: No SVHC; Lead Free: Lead Free; RoHS Compliant: Yes; ComponentLink1URL: https://datasheet.ciiva.com/46402/1817247-46402997.pdf?src-supplier=Element14; ComponentLink1Description: https://datasheet.ciiva.com/46402/1817247-46402997.pdf?src-supplier=Element14
U4 = MIC5504-3.3YM5-TR: MICROCHIP - MIC5504-3.3YM5-TR - LDO VOLT REG, 0.3A, 3.3V, SOT-23-5; Min Input Voltage: 2.5V; Max Input Voltage: 5.5V; Output Current: 300mA; Dropout Voltage: 380mV; Number of Outputs: 1; Quiescent Current: 38uA; Accuracy: 3%; Operating Supply Current: 42uA; Power Supply Rejection Ratio (PSRR): 60dB; Output Type: Fixed; Supplier 1: Digi-Key; Supplier Part Number 1: 576-4764-1-ND; Manufacturer 1: Microchip; Manufacturer Part Number 1: MIC5504-3.3YM5-TR; RoHS: Yes; Category: Voltage Regulators - Linear; Stock 1: 29072; Pricing 1: 1=0.13000, 25=0.09000 (USD); Mount: Surface Mount; Case/Package: SOT-23-5; Number of Pins: 5; Min Operating Temperature: -40°C; Max Operating Temperature: 125°C; Nominal Output Voltage: 3.3V; Packaging: Tape and Reel; Output Voltage: 3.3V; Max Output Current: 300mA; Length: 2.9mm; Width: 1.6mm; Height: 1.1mm; REACH SVHC: No SVHC; RoHS Compliant: No; ComponentLink1URL: https://datasheet.ciiva.com/46425/1856860-46425639.pdf?src-supplier=Element14; ComponentLink1Description: https://datasheet.ciiva.com/46425/1856860-46425639.pdf?src-supplier=Element14

## Sheet Gamepad_Sensors.SchDoc
size A; SheetNumber: 4; SheetTotal: 4
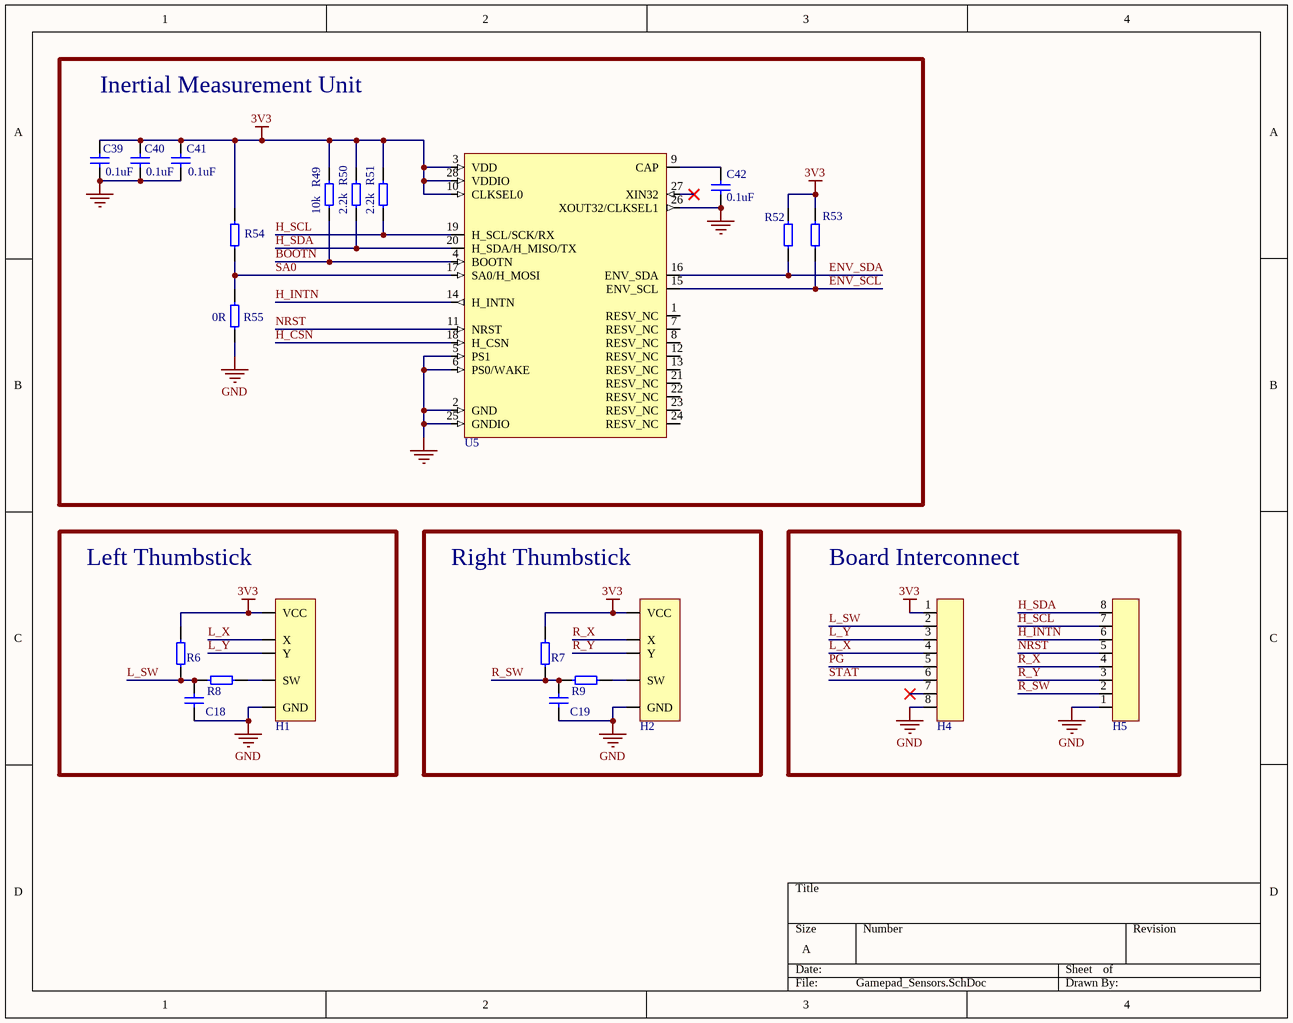
[diagram p3: Gamepad_Sensors.SchDoc]

### Parts
C18  Capacitor  [0603 Capacitor]  (value not drawn)
C19  Capacitor  [0603 Capacitor]  (value not drawn)
C39  0.1uF  [0603 Capacitor]
C40  0.1uF  [0603 Capacitor]
C41  0.1uF  [0603 Capacitor]
C42  0.1uF  [0603 Capacitor]
H1  Left Thumbstick  [THB001P]  (value not drawn)
H2  Right Thumbstick  [THB001P]  (value not drawn)
H4  8x1 Header  [SMD Header Female]  (value not drawn)
H5  8x1 Header  [SMD Header Female]  (value not drawn)
R6  Resistor  [0603 Resistor]  (value not drawn)
R7  Resistor  [0603 Resistor]  (value not drawn)
R8  Resistor  [0603 Resistor]  (value not drawn)
R9  Resistor  [0603 Resistor]  (value not drawn)
R49  10k  [0603 Resistor]
R50  2.2k  [0603 Resistor]
R51  2.2k  [0603 Resistor]
R52  Resistor  [0603 Resistor]  (value not drawn)
R53  Resistor  [0603 Resistor]  (value not drawn)
R54  Resistor  [0603 Resistor]  (value not drawn)
R55  0R  [0603 Resistor]
U5  BNO080  [BNO080]  (value not drawn)

### Blocks framed on the sheet
Inertial Measurement Unit: C39-C42 R49-R55 U5
Left Thumbstick: C18 H1 R6 R8
Right Thumbstick: C19 H2 R7 R9
Board Interconnect: H4 H5

### Nets
3V3: C39.2 C40.1 C41.2 H1.1(VCC) H2.1(VCC) H4.1 R6.2 R7.2 R49.2 R50.2 R51.2 R52.2 R53.2 R54.2 U5.3(VDD) U5.10(CLKSEL0) U5.28(VDDIO)
GND: C18.1 C19.1 C39.1 C40.2 C41.1 C42.1 H1.5(GND) H2.5(GND) H4.8 H5.1 R55.1 U5.2(GND) U5.5(PS1) U5.6(PS0/WAKE) U5.25(GNDIO) U5.26(XOUT32/CLKSEL1)
BOOTN: R49.1 U5.4(BOOTN)
ENV_SCL: R53.1 U5.15(ENV_SCL)
ENV_SDA: R52.1 U5.16(ENV_SDA)
H_CSN: U5.18(H_CSN)
H_INTN: H5.6 U5.14(H_INTN)
H_SCL: H5.7 R51.1 U5.19(H_SCL/SCK/RX)
H_SDA: H5.8 R50.1 U5.20(H_SDA/H_MISO/TX)
L_SW: C18.2 H4.2 R6.1 R8.1
L_X: H1.2(X) H4.4
L_Y: H1.3(Y) H4.3
NRST: H5.5 U5.11(NRST)
PG: H4.5
R_SW: C19.2 H5.2 R7.1 R9.1
R_X: H2.2(X) H5.4
R_Y: H2.3(Y) H5.3
SA0: R54.1 R55.2 U5.17(SA0/H_MOSI)
STAT: H4.6
NetC42_2: C42.2 U5.9(CAP)
NetH1_4: H1.4(SW) R8.2
NetH2_4: H2.4(SW) R9.2

Not connected (* = marked no-connect by the designer): H4 7*; U5 1(RESV_NC) 7(RESV_NC) 8(RESV_NC) 12(RESV_NC) 13(RESV_NC) 21(RESV_NC) 22(RESV_NC) 23(RESV_NC) 24(RESV_NC) 27(XIN32)*

### Library data of the parts
C39-C42 = Capacitor
H1 H2 = Thumbstick
R49-R51 R55 = Resistor
U5 = BNO080: IMU ACCEL/GYRO/MAG I2C 32BIT; Manufacturer 1: Hillcrest Laboratories; Sensor Type: Accelerometer,Gyroscope,Magnetometer; Output Type: SPI,I2C; Supplier 1: Digi-Key; Supplier Part Number 1: 1888-1000-1-ND; Manufacturer Part Number 1: BNO080; RoHS: No; Category: Inertial Measurement Units (IMUs); Mount: Surface Mount; Case/Package: LGA; Min Operating Temperature: -40°C; Max Operating Temperature: 85°C; Packaging: Tape and Reel; ComponentLink1URL: http://www.hillcrestlabs.com/download/5a05f340566d07c196001ec1?src-supplier=Digi-Key; ComponentLink1Description: http://www.hillcrestlabs.com/download/5a05f340566d07c196001ec1?src-supplier=Digi-Key

## Nets that join several sheets
3V3: Battery_Manager (C37.2 U4.5), Gamepad_Sensors (17 pins)
GND: nRF52832_Schematic (25 pins), Gamepad_IO (27 pins), Battery_Manager (25 pins), Gamepad_Sensors (16 pins)
VDD_nRF: nRF52832_Schematic (8 pins), Gamepad_IO (11 pins)
P0.09: nRF52832_Schematic (H6.2 U1.11), Gamepad_IO (C24.2 R16.1 R19.2)
P0.10: nRF52832_Schematic (U1.12), Gamepad_IO (C22.2 R14.1 R17.2)
P0.11: nRF52832_Schematic (U1.14), Gamepad_IO (C23.2 R15.1 R18.2)
P0.16: nRF52832_Schematic (H7.5 U1.19), Gamepad_IO (C26.2 R21.1 R23.2)
P0.17: nRF52832_Schematic (H7.6 U1.20), Gamepad_IO (C25.2 R20.1 R22.2)
P0.18: nRF52832_Schematic (U1.21), Gamepad_IO (C27.2 R26.1 R30.2)
P0.19: nRF52832_Schematic (U1.22), Gamepad_IO (C28.2 R27.1 R31.2)
P0.20: nRF52832_Schematic (U1.23), Gamepad_IO (R34.1)
P0.21: nRF52832_Schematic (U1.24), Gamepad_IO (R32.1)
P0.22: nRF52832_Schematic (U1.27), Gamepad_IO (R28.1)
P0.23: nRF52832_Schematic (U1.28), Gamepad_IO (R25.1)
P0.24: nRF52832_Schematic (U1.29), Gamepad_IO (R24.1)
P0.26: nRF52832_Schematic (C14.1 U1.38), Gamepad_IO (C21.2 R11.1 R13.2)
P0.27: nRF52832_Schematic (H6.8 U1.39), Gamepad_IO (C17.2 R3.1 R5.2)
P0.28/AIN4: nRF52832_Schematic (H6.7 U1.40), Gamepad_IO (C16.2 R2.1 R4.2)
P0.29/AIN5: nRF52832_Schematic (H6.6 U1.41), Gamepad_IO (C20.2 R10.1 R12.2)
PG: Battery_Manager (R39.1 U2.7), Gamepad_Sensors (H4.5)
STAT: Battery_Manager (R38.1 U2.5), Gamepad_Sensors (H4.6)